# Altium schematic sheet SOUND_SEC.SchDoc
size A4; SheetNumber: 7; SheetTotal: 30
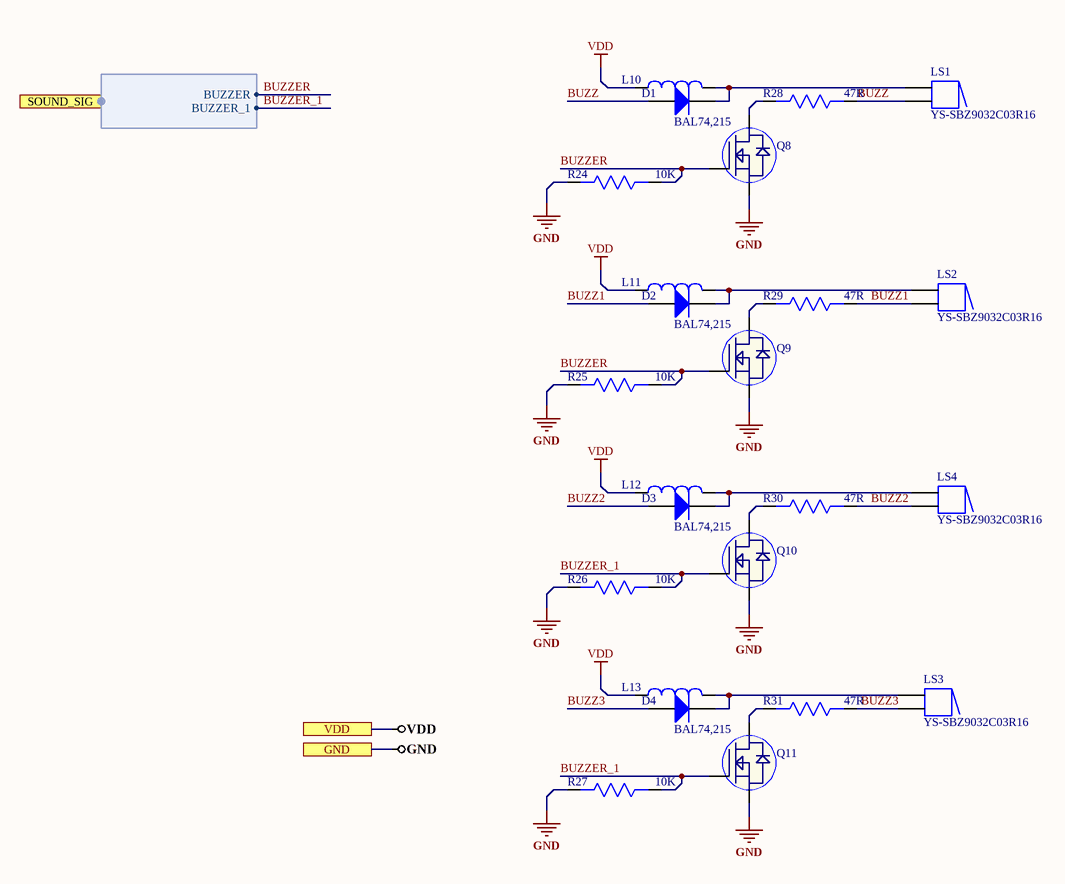
[diagram p0: SOUND_SEC.SchDoc]

## Parts
D1  BAL74,215  [SOT23-3]
D2  BAL74,215  [SOT23-3]
D3  BAL74,215  [SOT23-3]
D4  BAL74,215  [SOT23-3]
L10  MMZ0603S601CT000  [IND 0201]  (value not drawn)
L11  MMZ0603S601CT000  [IND 0201]  (value not drawn)
L12  MMZ0603S601CT000  [IND 0201]  (value not drawn)
L13  MMZ0603S601CT000  [IND 0201]  (value not drawn)
LS1  YS-SBZ9032C03R16  [YS-SBZ9032C03R16]
LS2  YS-SBZ9032C03R16  [YS-SBZ9032C03R16]
LS3  YS-SBZ9032C03R16  [YS-SBZ9032C03R16]
LS4  YS-SBZ9032C03R16  [YS-SBZ9032C03R16]
Q8  BSS138LT1G  [SOT23-3]  (value not drawn)
Q9  BSS138LT1G  [SOT23-3]  (value not drawn)
Q10  BSS138LT1G  [SOT23-3]  (value not drawn)
Q11  BSS138LT1G  [SOT23-3]  (value not drawn)
R24  10K  [Res-0201]
R25  10K  [Res-0201]
R26  10K  [Res-0201]
R27  10K  [Res-0201]
R28  47R  [Res-0201]
R29  47R  [Res-0201]
R30  47R  [Res-0201]
R31  47R  [Res-0201]

## Ports
GND, SOUND_SIG (harness Harness_4), VDD

## Harnesses
Harness_4: BUZZER, BUZZER_1

## Nets
GND: Q8.2(S) Q9.2(S) Q10.2(S) Q11.2(S) R24.2 R25.2 R26.2 R27.2 ; port GND
VDD: L10.1 L11.1 L12.1 L13.1 ; port VDD
BUZZ: D1.2(A) LS1.2 R28.1
BUZZ1: D2.2(A) LS2.2 R29.1
BUZZ2: D3.2(A) LS4.2 R30.1
BUZZ3: D4.2(A) LS3.2 R31.1
BUZZER: Q8.1(G) Q9.1(G) R24.1 R25.1 ; port SOUND_SIG.BUZZER
BUZZER_1: Q10.1(G) Q11.1(G) R26.1 R27.1 ; port SOUND_SIG.BUZZER_1
NetD1_1: D1.1(K) L10.2 LS1.1
NetD2_1: D2.1(K) L11.2 LS2.1
NetD3_1: D3.1(K) L12.2 LS4.1
NetD4_1: D4.1(K) L13.2 LS3.1
NetQ8_3: Q8.3(D) R28.2
NetQ9_3: Q9.3(D) R29.2
NetQ10_3: Q10.3(D) R30.2
NetQ11_3: Q11.3(D) R31.2

## Library data of the parts
D1-D4 = BAL74,215: DIODE GEN PURP 50V 215MA SOT23; Manufacturer: NXP Semiconductors; Manufacturer Part Number: BAL74215; Element Configuration: Single; Forward Current: 150mA; Max Reverse Current: 100nA; Reverse Recovery Time: 4ns; Peak Non-Repetitive Surge Current: 4A; Forward Voltage: 1.25V; Supplier 1: Newark; RoHS: Yes; Category: Rectifier Diodes; Mount: Surface Mount; Case/Package: TO-236-3; Number of Pins: 3; Contact Plating: Tin; Min Operating Temperature: -65°C; Max Operating Temperature: 150°C; Max Repetitive Reverse Voltage (Vrrm): 50V; Packaging: Tape and Reel; Max Surge Current: 4A; Recovery Time: 4ns; Package Quantity: 1; Max Reverse Leakage Current: 100nA; Average Rectified Current: 215mA; Max Forward Surge Current (Ifsm): 4A; Termination: SMD/SMT; Max Reverse Voltage (DC): 50V; Radiation Hardening: No; REACH SVHC: No SVHC; Lead Free: Lead Free; ComponentLink1URL: https://datasheet.ciiva.com/8299/bal74-8299264.pdf?src-supplier=Avnet; ComponentLink1Description: https://datasheet.ciiva.com/8299/bal74-8299264.pdf?src-supplier=Avnet; ComponentLink2URL: https://datasheet.ciiva.com/1179/453930-1179601.pdf?src-supplier=Element14; ComponentLink2Description: https://datasheet.ciiva.com/1179/453930-1179601.pdf?src-supplier=Element14; ComponentLink3URL: https://datasheet.ciiva.com/4434/bal74-109975-4434835.pdf?src-supplier=Mouser; ComponentLink3Description: https://datasheet.ciiva.com/4434/bal74-109975-4434835.pdf?src-supplier=Mouser; ComponentLink4URL: https://datasheet.ciiva.com/25953/bal74-25953738.pdf?src-supplier=Avnet+Europe; ComponentLink4Description: https://datasheet.ciiva.com/25953/bal74-25953738.pdf?src-supplier=Avnet+Europe; ComponentLink5URL: https://datasheet.ciiva.com/912/bal74-912156.pdf?src-supplier=Digi-Key; ComponentLink5Description: https://datasheet.ciiva.com/912/bal74-912156.pdf?src-supplier=Digi-Key; ComponentLink6URL: https://datasheet.ciiva.com/1202/453930-1202220.pdf?src-supplier=Farnell; ComponentLink6Description: https://datasheet.ciiva.com/1202/453930-1202220.pdf?src-supplier=Farnell; ComponentLink7URL: https://datasheet.ciiva.com/912/bal74-912157.pdf?src-supplier=Digi-Key; ComponentLink7Description: https://datasheet.ciiva.com/912/bal74-912157.pdf?src-supplier=Digi-Key; ComponentLink8URL: https://datasheet.ciiva.com/1202/453930-1202221.pdf?src-supplier=Farnell; ComponentLink8Description: https://datasheet.ciiva.com/1202/453930-1202221.pdf?src-supplier=Farnell; ComponentLink9URL: https://datasheet.ciiva.com/912/bal74-912158.pdf?src-supplier=Digi-Key; ComponentLink9Description: https://datasheet.ciiva.com/912/bal74-912158.pdf?src-supplier=Digi-Key; Supplier Part Number 1: 75R4923
L10-L13 = MMZ0603S601CT000: FERRITE BEAD 600 OHM 0201 1LN; Manufacturer: TDK; Impedance: 600R; Tolerance: 25%; DC Resistance (DCR): 1.45R; Max DC Current: 100mA; Supplier 1: Digi-Key; Manufacturer Part Number: MMZ0603S601CT000; RoHS: Yes; Category: Inductors; Stock 1: 1540; Pricing 1: 1=0.12000, 10=0.09900, 25=0.07680, 50=0.06380, 100=0.05500, 250=0.04400, 500=0.03960, 1000=0.03300, 5000=0.03080 (USD); Mount: Surface Mount; Case/Package: 0201; Core Material: Ferrite; Case Code (Metric): 0603; Case Code (Imperial): 0201; Packaging: Cut Tape; Package Quantity: 15000; Current Rating: 100mA; Length: 0.024inch; Width: 0.012inch; Height: 0.013inch; REACH SVHC: No SVHC; Lead Free: Lead Free; RoHS Compliant: Yes; ComponentLink1URL: https://datasheet.ciiva.com/46381/1795294-46381669.pdf?src-supplier=Element14; ComponentLink1Description: https://datasheet.ciiva.com/46381/1795294-46381669.pdf?src-supplier=Element14; ComponentLink2URL: https://datasheet.ciiva.com/46634/beads-commercial-signal-mmz-en-46634390.pdf?src-supplier=Digi-Key; ComponentLink2Description: https://datasheet.ciiva.com/46634/beads-commercial-signal-mmz-en-46634390.pdf?src-supplier=Digi-Key; ComponentLink3URL: https://datasheet.ciiva.com/48682/beads-commercial-signal-mmz-en-48682603.pdf?src-supplier=Avnet; ComponentLink3Description: https://datasheet.ciiva.com/48682/beads-commercial-signal-mmz-en-48682603.pdf?src-supplier=Avnet; ComponentLink4URL: https://datasheet.ciiva.com/46634/beads-commercial-signal-mmz-en-46634381.pdf?src-supplier=Digi-Key; ComponentLink4Description: https://datasheet.ciiva.com/46634/beads-commercial-signal-mmz-en-46634381.pdf?src-supplier=Digi-Key; Supplier Part Number 1: 445-2146-1-ND
LS1-LS4 = YS-SBZ9032C03R16: NO 2700Hz 85dB @ 3V, 10cm 3V Φ9mm SMD,9x3.2mm Buzzers RoHS; Manufacturer: Fengming; Operating Voltage: 2 ~ 4V; Package: SMD,9x3.2mm; Frequency - Self Resonant: 2700Hz; Rated Voltage: 3V
Q8-Q11 = BSS138LT1G: MOSFET N-CH 50V 200MA SOT-23; Manufacturer: ON Semiconductor; Gate to Source Voltage (Vgs): 20V; Nominal Vgs: 1.5V; Rds On Max: 3.5R; Input Capacitance: 50pF; Number of Elements: 1; Max Power Dissipation: 225mW; Turn-Off Delay Time: 20ns; Element Configuration: Single; ComponentLink1URL: https://datasheet.ciiva.com/22641/1596366-22641636.pdf; ComponentLink1Description: https://datasheet.ciiva.com/22641/1596366-22641636.pdf; ComponentLink2URL: https://datasheet.ciiva.com/1190/1596366-1190137.pdf; ComponentLink2Description: https://datasheet.ciiva.com/1190/1596366-1190137.pdf; ComponentLink3URL: https://datasheet.ciiva.com/15198/getdatasheetpartid-110266-15198908.pdf; ComponentLink3Description: https://datasheet.ciiva.com/15198/getdatasheetpartid-110266-15198908.pdf; ComponentLink4URL: https://datasheet.ciiva.com/8115/bss138lt1-d-8115295.pdf; ComponentLink4Description: https://datasheet.ciiva.com/8115/bss138lt1-d-8115295.pdf; ComponentLink5URL: https://datasheet.ciiva.com/8115/bss138lt1-d-8115358.pdf; ComponentLink5Description: https://datasheet.ciiva.com/8115/bss138lt1-d-8115358.pdf; ComponentLink6URL: https://datasheet.ciiva.com/1190/1596366-1190136.pdf; ComponentLink6Description: https://datasheet.ciiva.com/1190/1596366-1190136.pdf; ComponentLink7URL: https://datasheet.ciiva.com/936/bss138lt1-d-936802.pdf; ComponentLink7Description: https://datasheet.ciiva.com/936/bss138lt1-d-936802.pdf; ComponentLink8URL: https://datasheet.ciiva.com/936/bss138lt1-d-936801.pdf; ComponentLink8Description: https://datasheet.ciiva.com/936/bss138lt1-d-936801.pdf; ComponentLink9URL: https://datasheet.ciiva.com/14553/70099493-14553829.pdf; ComponentLink9Description: https://datasheet.ciiva.com/14553/70099493-14553829.pdf; ComponentLink10URL: https://datasheet.ciiva.com/936/bss138lt1-d-936803.pdf; ComponentLink10Description: https://datasheet.ciiva.com/936/bss138lt1-d-936803.pdf; Supplier 1: Digi-Key; Manufacturer Part Number: BSS138LT1G; Stock 1: 1283212; Pricing 1: 1=0.27, 10=0.222, 100=0.1177, 500=0.07746, 1000=0.05267 (USD); Case/Package: SOT-23-3; Number of Pins: 3; Contact Plating: Tin,Matte; Min Operating Temperature: -55°C; Max Operating Temperature: 150°C; Continuous Drain Current (ID): 200mA; Package Quantity: 1; Packaging: Tape and Reel; Drain to Source Breakdown Voltage: 50V; Power Dissipation: 225mW; Drain to Source Resistance: 3.5R; Threshold Voltage: 1.5V; Turn-On Delay Time: 20ns; Voltage Rating (DC): 50V; Current Rating: 200mA; On-State Resistance: 3.5R; Length: 3.04mm; Height: 1.01mm; Width: 1.4mm; Radiation Hardening: No; REACH SVHC: No SVHC; Lead Free: Lead Free; Halogen Free: Halogen Free; ComponentLink11URL: http://www.onsemi.com/pub/Collateral/BSS138LT1-D.PDF?src-supplier=Digi-Key; ComponentLink11Description: http://www.onsemi.com/pub/Collateral/BSS138LT1-D.PDF?src-supplier=Digi-Key; ComponentLink12URL: http://www.farnell.com/datasheets/1596366.pdf?src-supplier=Element14; ComponentLink12Description: http://www.farnell.com/datasheets/1596366.pdf?src-supplier=Element14; ComponentLink13URL: http://www.alliedelec.com/m/d/b3c6fd7d92596813fe75d33dcbaaae90.pdf?src-supplier=Allied+Electronics; ComponentLink13Description: http://www.alliedelec.com/m/d/b3c6fd7d92596813fe75d33dcbaaae90.pdf?src-supplier=Allied+Electronics; ComponentLink14URL: https://www.verical.com/server-webapp/html/getDatasheet?partID=110266&src-supplier=Verical; ComponentLink14Description: https://www.verical.com/server-webapp/html/getDatasheet?partID=110266&src-supplier=Verical; ComponentLink15URL: http://www.onsemi.com/pub_link/Collateral/BSS138LT1-D.PDF?src-supplier=Avnet; ComponentLink15Description: http://www.onsemi.com/pub_link/Collateral/BSS138LT1-D.PDF?src-supplier=Avnet; Supplier Part Number 1: BSS138LT1GOSDKR-ND
R24-R27 = RC0201FR-0710KL: RES SMD 10K OHM 1% 1/20W 0201; Manufacturer: Yageo; Temperature Coefficient: 200ppm/°C; Resistance: 10kR; Max Power Dissipation: 50mW; Working Voltage: 25V; Supplier 1: Digi-Key; Manufacturer Part Number: RC0201FR-0710KL; RoHS: Yes; Category: Chip SMD Resistors; Stock 1: 6892350; Pricing 1: 1=0.10000, 10=0.03600, 100=0.01480, 1000=0.00665, 2500=0.00577, 5000=0.00477 (USD); Case/Package: 0201; Number of Pins: 2; Contact Plating: Tin,Matte; Weight: 6E-06oz; Case Code (Imperial): 0201; Case Code (Metric): 0603; Min Operating Temperature: -55°C; Max Operating Temperature: 125°C; Resistor Type: Thick Film; Tolerance: 1%; Features: Moisture Resistant; Termination: SMD/SMT; Number of Terminations: 2; Power Rating: 50mW; Voltage Rating: 25V; Packaging: Tape and Reel; Package Quantity: 1; Voltage Rating (DC): 25V; Length: 0.6mm; Width: 0.3mm; Height: 0.01inch; Depth: 0.3mm; Radiation Hardening: No; REACH SVHC: No SVHC; Military Standard: Not; Lead Free: Lead Free; ComponentLink1URL: https://datasheet.ciiva.com/2467/pyu-r-int-thick-7-2467109.pdf?src-supplier=Digi-Key; ComponentLink1Description: https://datasheet.ciiva.com/2467/pyu-r-int-thick-7-2467109.pdf?src-supplier=Digi-Key; ComponentLink2URL: https://datasheet.ciiva.com/2467/pyu-r-int-thick-7-2467110.pdf?src-supplier=Digi-Key; ComponentLink2Description: https://datasheet.ciiva.com/2467/pyu-r-int-thick-7-2467110.pdf?src-supplier=Digi-Key; ComponentLink3URL: https://datasheet.ciiva.com/2467/pyu-r-int-thick-7-2467111.pdf?src-supplier=Digi-Key; ComponentLink3Description: https://datasheet.ciiva.com/2467/pyu-r-int-thick-7-2467111.pdf?src-supplier=Digi-Key; ComponentLink4URL: https://datasheet.ciiva.com/7660/1421516-7660807.pdf?src-supplier=Element14; ComponentLink4Description: https://datasheet.ciiva.com/7660/1421516-7660807.pdf?src-supplier=Element14; ComponentLink5URL: https://datasheet.ciiva.com/8891/pyu-rc0201-51-rohs-l-8-8891384.pdf?src-supplier=Avnet; ComponentLink5Description: https://datasheet.ciiva.com/8891/pyu-rc0201-51-rohs-l-8-8891384.pdf?src-supplier=Avnet; ComponentLink6URL: https://datasheet.ciiva.com/28405/pyu-rc0201-51-rohs-l-8-28405609.pdf?src-supplier=Avnet+Europe; ComponentLink6Description: https://datasheet.ciiva.com/28405/pyu-rc0201-51-rohs-l-8-28405609.pdf?src-supplier=Avnet+Europe; ComponentLink7URL: https://datasheet.ciiva.com/26829/getdatasheetpartid-421074-26829851.pdf?src-supplier=Verical; ComponentLink7Description: https://datasheet.ciiva.com/26829/getdatasheetpartid-421074-26829851.pdf?src-supplier=Verical; ComponentLink8URL: https://datasheet.ciiva.com/46391/1421516-46391339.pdf?src-supplier=Element14; ComponentLink8Description: https://datasheet.ciiva.com/46391/1421516-46391339.pdf?src-supplier=Element14; ComponentLink9URL: https://datasheet.ciiva.com/16855/pyu-rc0201-51-rohs-l-8-16855789.pdf?src-supplier=Avnet+Europe; ComponentLink9Description: https://datasheet.ciiva.com/16855/pyu-rc0201-51-rohs-l-8-16855789.pdf?src-supplier=Avnet+Europe; Supplier Part Number 1: 311-10.0KMCT-ND
R28-R31 = RK73H1HTTC47R0F: RES 47 OHM 1% 1/20W 0201; Manufacturer: KOA Speer; Power Rating: 50mW; Voltage Rating: 25V; Temperature Coefficient: 200ppm/°C; Supplier 1: Digi-Key; Manufacturer Part Number: RK73H1HTTC47R0F; RoHS: Yes; Category: Chip SMD Resistors; Stock 1: 7660; Pricing 1: 1=0.10000, 10=0.07500, 100=0.03050, 1000=0.01370, 2500=0.01189, 5000=0.00982 (USD); Case/Package: 0201; Case Code (Imperial): 0201; Case Code (Metric): 0603; Min Operating Temperature: -55°C; Max Operating Temperature: 125°C; Resistance: 47R; Tolerance: 1%; Packaging: Tape and Reel; Resistor Type: Thick Film; Termination: SMD/SMT; Voltage Rating (DC): 25V; Series: RK73H; Construction: Rectangular; Length: 0.6mm; Depth: 0.3mm; Military Standard: Not; RoHS Compliant: Yes; ComponentLink1URL: https://datasheet.ciiva.com/5552/rk73h-5552712.pdf?src-supplier=Mouser; ComponentLink1Description: https://datasheet.ciiva.com/5552/rk73h-5552712.pdf?src-supplier=Mouser; Supplier Part Number 1: 2019-RK73H1HTTC47R0FCT-ND